# EAGLE design HapticSleeveSchematic3 - Copy (EAGLE 9.6.2)
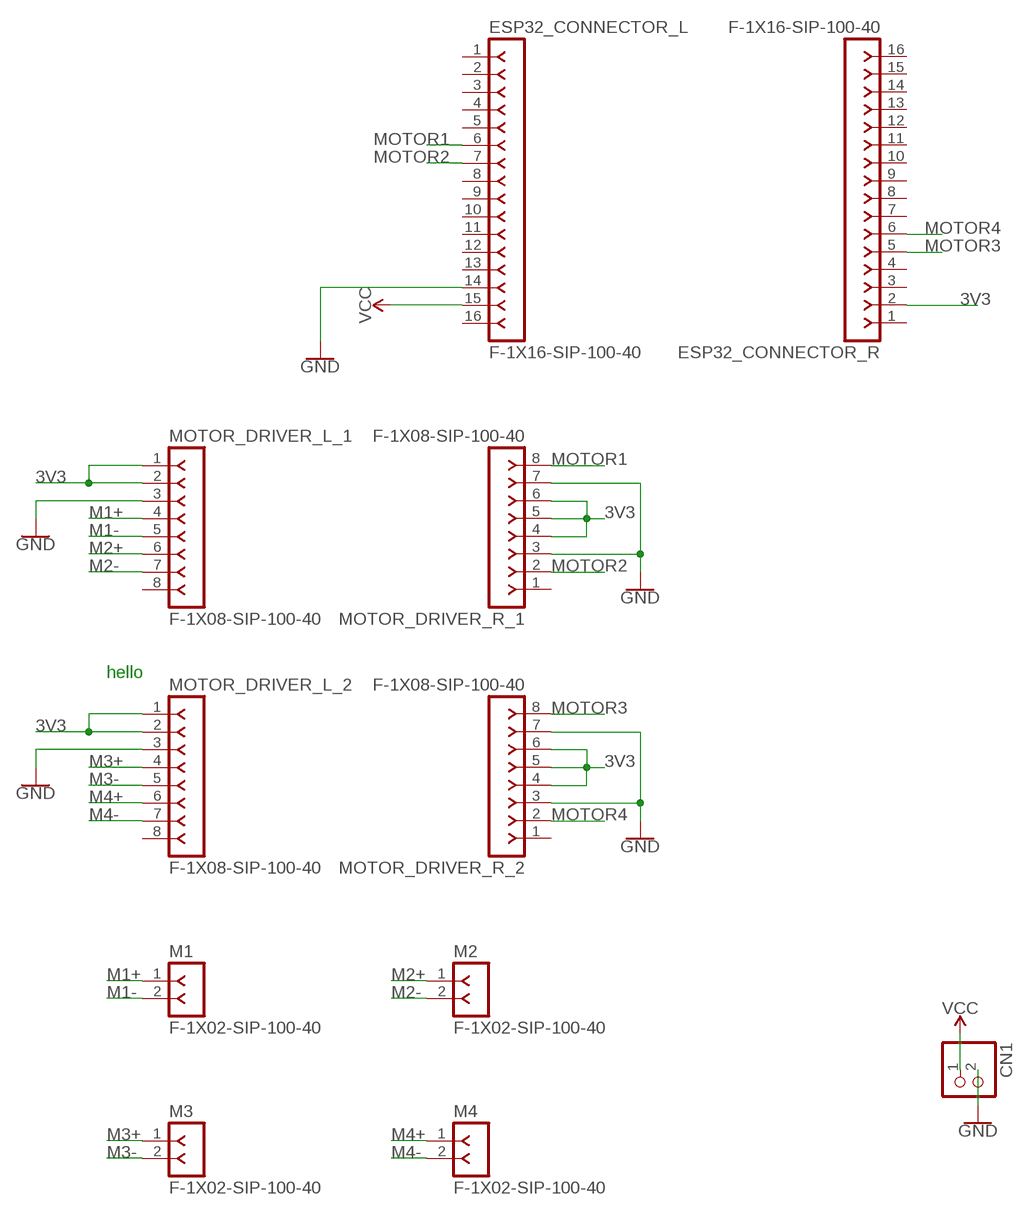
[diagram p0: schematic, sheet 1]

## Parts
CN1  JST_2PIN-THM-RA  [JST-PH-2-THM-RA]
ESP32_CONNECTOR_L  F-1X16-SIP-100-40  [SIP-100-16-40]
ESP32_CONNECTOR_R  F-1X16-SIP-100-40  [SIP-100-16-40]
M1  F-1X02-SIP-100-40  [SIP-100-02-40]
M2  F-1X02-SIP-100-40  [SIP-100-02-40]
M3  F-1X02-SIP-100-40  [SIP-100-02-40]
M4  F-1X02-SIP-100-40  [SIP-100-02-40]
MOTOR_DRIVER_L_1  F-1X08-SIP-100-40  [SIP-100-08-40]
MOTOR_DRIVER_L_2  F-1X08-SIP-100-40  [SIP-100-08-40]
MOTOR_DRIVER_R_1  F-1X08-SIP-100-40  [SIP-100-08-40]
MOTOR_DRIVER_R_2  F-1X08-SIP-100-40  [SIP-100-08-40]

## Nets
3V3: ESP32_CONNECTOR_R.2 MOTOR_DRIVER_L_1.1 MOTOR_DRIVER_L_1.2 MOTOR_DRIVER_L_2.1 MOTOR_DRIVER_L_2.2 MOTOR_DRIVER_R_1.4 MOTOR_DRIVER_R_1.5 MOTOR_DRIVER_R_1.6 MOTOR_DRIVER_R_2.4 MOTOR_DRIVER_R_2.5 MOTOR_DRIVER_R_2.6
GND: CN1.2 ESP32_CONNECTOR_L.14 MOTOR_DRIVER_L_1.3 MOTOR_DRIVER_L_2.3 MOTOR_DRIVER_R_1.3 MOTOR_DRIVER_R_1.7 MOTOR_DRIVER_R_2.3 MOTOR_DRIVER_R_2.7
M1+: M1.1 MOTOR_DRIVER_L_1.4
M1-: M1.2 MOTOR_DRIVER_L_1.5
M2+: M2.1 MOTOR_DRIVER_L_1.6
M2-: M2.2 MOTOR_DRIVER_L_1.7
M3+: M3.1 MOTOR_DRIVER_L_2.4
M3-: M3.2 MOTOR_DRIVER_L_2.5
M4+: M4.1 MOTOR_DRIVER_L_2.6
M4-: M4.2 MOTOR_DRIVER_L_2.7
MOTOR1: ESP32_CONNECTOR_L.6 MOTOR_DRIVER_R_1.8
MOTOR2: ESP32_CONNECTOR_L.7 MOTOR_DRIVER_R_1.2
MOTOR3: ESP32_CONNECTOR_R.5 MOTOR_DRIVER_R_2.8
MOTOR4: ESP32_CONNECTOR_R.6 MOTOR_DRIVER_R_2.2
VCC: CN1.1 ESP32_CONNECTOR_L.15
Unconnected: ESP32_CONNECTOR_L.1 ESP32_CONNECTOR_L.2 ESP32_CONNECTOR_L.3 ESP32_CONNECTOR_L.4 ESP32_CONNECTOR_L.5 ESP32_CONNECTOR_L.8 ESP32_CONNECTOR_L.9 ESP32_CONNECTOR_L.10 ESP32_CONNECTOR_L.11 ESP32_CONNECTOR_L.12 ESP32_CONNECTOR_L.13 ESP32_CONNECTOR_L.16 ESP32_CONNECTOR_R.1 ESP32_CONNECTOR_R.3 ESP32_CONNECTOR_R.4 ESP32_CONNECTOR_R.7 ESP32_CONNECTOR_R.8 ESP32_CONNECTOR_R.9 ESP32_CONNECTOR_R.10 ESP32_CONNECTOR_R.11 ESP32_CONNECTOR_R.12 ESP32_CONNECTOR_R.13 ESP32_CONNECTOR_R.14 ESP32_CONNECTOR_R.15 ESP32_CONNECTOR_R.16 MOTOR_DRIVER_L_1.8 MOTOR_DRIVER_L_2.8 MOTOR_DRIVER_R_1.1 MOTOR_DRIVER_R_2.1

## Notes on the sheet
- hello

## Library data of the parts
CN1 = adafruit:JST_2PIN: JST 2-Pin Connectors of various flavors SMT-RA (S2B-PH-SM4) 4UConnector #17311 SMT (B2B-PH-SM4) THM-RA (S2B-PH) THM (B2B-PH)
ESP32_CONNECTOR_L ESP32_CONNECTOR_R = con-headers-jp-1:F-1X16-: FEMALE HEADER
M1-M4 = con-headers-jp-1:F-1X02-: FEMALE HEADER
MOTOR_DRIVER_L_1 MOTOR_DRIVER_L_2 MOTOR_DRIVER_R_1 MOTOR_DRIVER_R_2 = con-headers-jp-1:F-1X08-: FEMALE HEADER

## Board
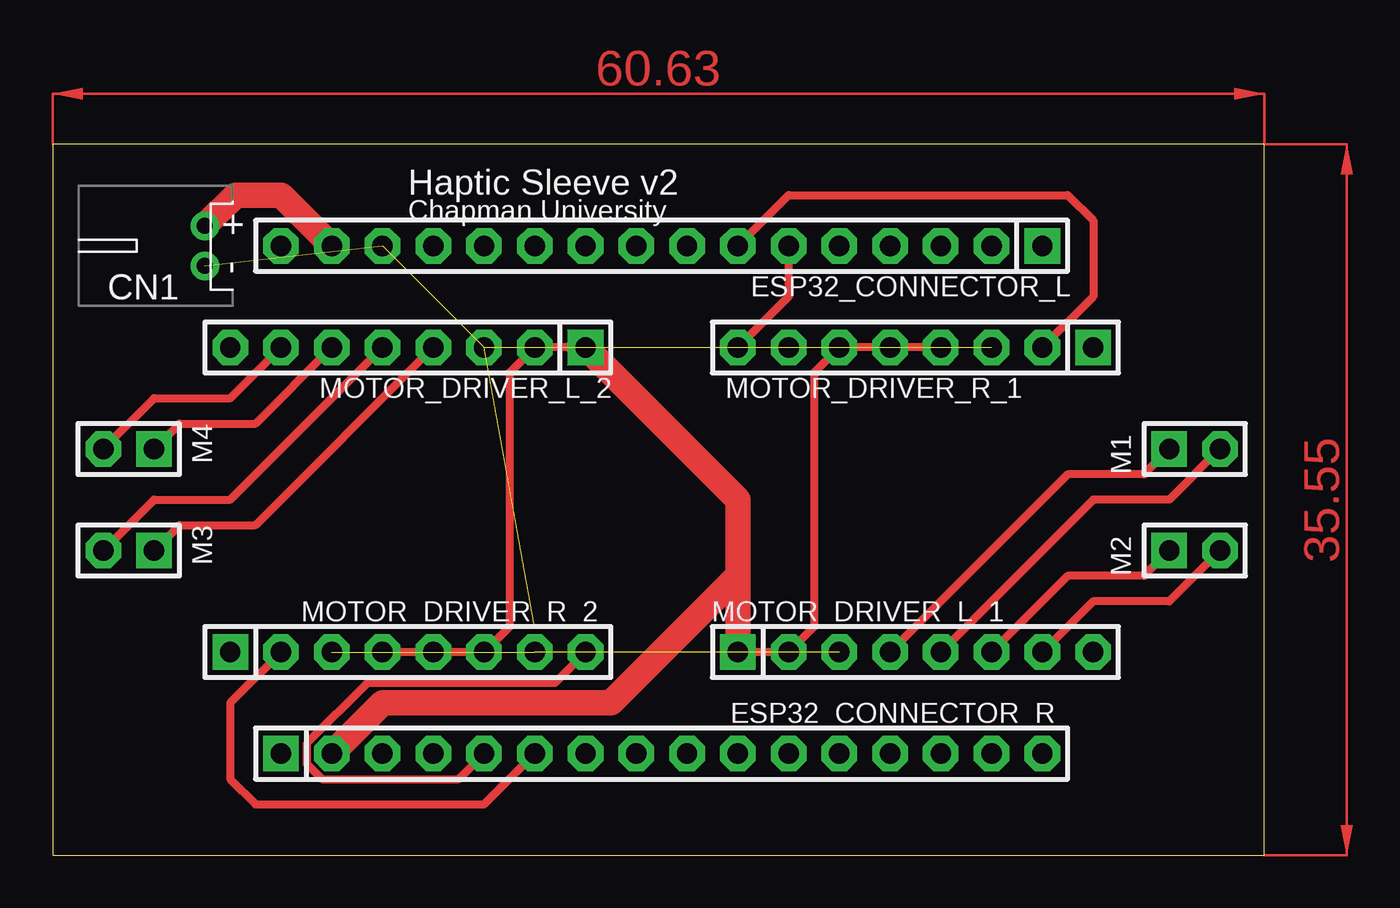
[diagram p1: board, top side]
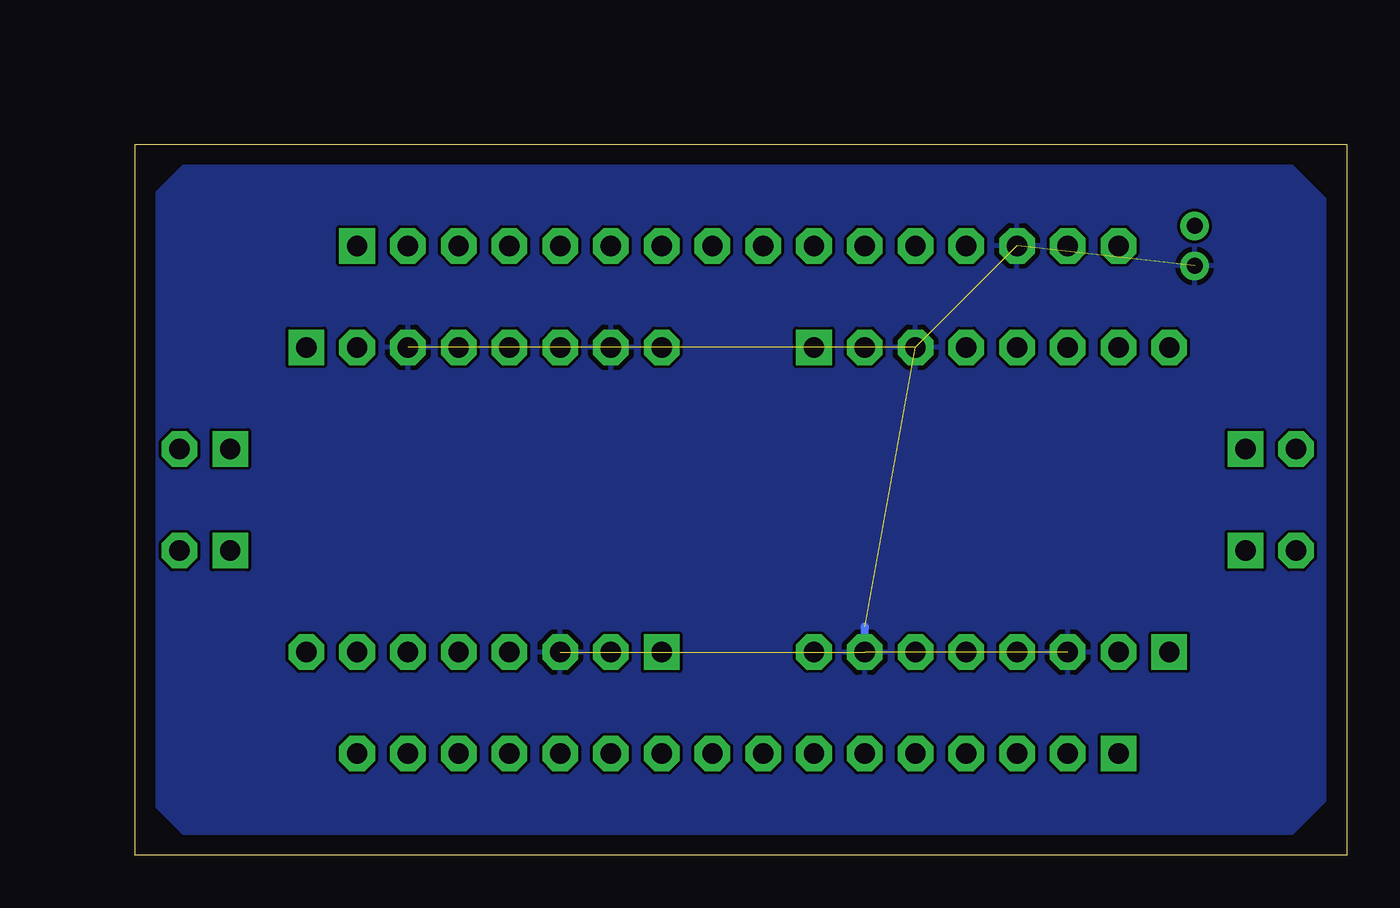
[diagram p2: board, bottom side, seen from below]

Size 60.63 x 35.55 mm. Coordinates in mm from the lower left corner, seen from the top.
Outline: 0,0 60.63,0 60.63,35.55 0,35.55 0,0
Copper layers (1*16): Top 0.035mm / dielectric 1.5mm / Bottom 0.035mm
Design rules "default": minimum track width 6mil, minimum drill 0.35mm, track to track 6mil, track to pad 6mil, pad to pad 6mil, via to via 6mil, smd to smd 6mil, copper to edge 40mil, drill to drill 6mil, minimum pad ring 10mil, minimum via ring 8mil, stop-mask expansion 4mil, vias tented up to drill 0mil, thermal gap 10mil

### Footprints (pad centres in the part's own frame; a part is rotated, then mirrored left to right if it is on the bottom)
JST-PH-2-THM-RA = drill 0.8 pad 1.422: 1 1,0; 2 -1,0
SIP-100-16-40 = drill 1.016 pad 1.778 square: 1 -19.05,0 | drill 1.016 pad 1.778 octagon: 2 -16.51,0; 3 -13.97,0; 4 -11.43,0; 5 -8.89,0; 6 -6.35,0; 7 -3.81,0; 8 -1.27,0; 9 1.27,0; 10 3.81,0; 11 6.35,0; 12 8.89,0; 13 11.43,0; 14 13.97,0; 15 16.51,0; 16 19.05,0
SIP-100-02-40 = drill 1.016 pad 1.778 square: 1 -1.27,0 | drill 1.016 pad 1.778 octagon: 2 1.27,0
SIP-100-08-40 = drill 1.016 pad 1.778 square: 1 -8.89,0 | drill 1.016 pad 1.778 octagon: 2 -6.35,0; 3 -3.81,0; 4 -1.27,0; 5 1.27,0; 6 3.81,0; 7 6.35,0; 8 8.89,0

### Placement (x,y rotation side)
CN1  7.62,30.48 90 top
ESP32_CONNECTOR_L  30.48,30.48 180 top
ESP32_CONNECTOR_R  30.48,5.08 0 top
M1  57.15,20.32 0 top
M2  57.15,15.24 0 top
M3  3.81,15.24 180 top
M4  3.81,20.32 180 top
MOTOR_DRIVER_L_1  43.18,10.16 0 top
MOTOR_DRIVER_L_2  17.78,25.4 180 top
MOTOR_DRIVER_R_1  43.18,25.4 180 top
MOTOR_DRIVER_R_2  17.78,10.16 0 top

### Tracks (layer width: path | path; a pad name or v marks a point on that pad's centre or on a via)
3V3
  Top 0.406: MOTOR_DRIVER_R_1.4 MOTOR_DRIVER_R_1.5 MOTOR_DRIVER_R_1.6 38.1,24.13 38.1,11.43 MOTOR_DRIVER_L_1.2 MOTOR_DRIVER_L_1.1 | MOTOR_DRIVER_L_2.1 MOTOR_DRIVER_L_2.2 22.86,24.13 22.86,11.43 MOTOR_DRIVER_R_2.6 MOTOR_DRIVER_R_2.5 MOTOR_DRIVER_R_2.4
  Top 1.27: MOTOR_DRIVER_L_2.1 34.29,17.78 34.29,13.97 | 34.29,13.97 MOTOR_DRIVER_L_1.1 | 34.29,13.97 27.94,7.62 16.51,7.62 ESP32_CONNECTOR_R.2
GND  (7 unrouted)
  Bottom 0.406: MOTOR_DRIVER_R_2.7 24.13,11.43
  pour Bottom: 3.81,35.56 57.15,35.56 60.96,31.75 60.96,3.81 57.15,0 3.81,0 0,3.81 0,31.75
M1+
  Top 0.406: M1.1 54.61,19.05 50.8,19.05 MOTOR_DRIVER_L_1.4
M1-
  Top 0.406: M1.2 55.88,17.78 52.07,17.78 MOTOR_DRIVER_L_1.5
M2+
  Top 0.406: M2.1 54.61,13.97 50.8,13.97 MOTOR_DRIVER_L_1.6
M2-
  Top 0.406: M2.2 55.88,12.7 52.07,12.7 MOTOR_DRIVER_L_1.7
M3+
  Top 0.406: M3.1 6.35,16.51 10.16,16.51 MOTOR_DRIVER_L_2.4
M3-
  Top 0.406: M3.2 5.08,17.78 8.89,17.78 MOTOR_DRIVER_L_2.5
M4+
  Top 0.406: M4.1 6.35,21.59 10.16,21.59 MOTOR_DRIVER_L_2.6
M4-
  Top 0.406: M4.2 5.08,22.86 8.89,22.86 MOTOR_DRIVER_L_2.7
MOTOR1
  Top 0.406: ESP32_CONNECTOR_L.6 36.83,27.94 MOTOR_DRIVER_R_1.8
MOTOR2
  Top 0.406: ESP32_CONNECTOR_L.7 36.83,33.02 50.8,33.02 52.07,31.75 52.07,27.94 MOTOR_DRIVER_R_1.2
MOTOR3
  Top 0.406: MOTOR_DRIVER_R_2.8 25.12,8.61 15.74,8.61 12.72,5.6 12.72,4.56 13.48,3.81 20.32,3.81 ESP32_CONNECTOR_R.5
MOTOR4
  Top 0.406: MOTOR_DRIVER_R_2.2 8.89,7.62 8.89,3.81 10.16,2.54 21.59,2.54 ESP32_CONNECTOR_R.6
VCC
  Top 1.27: CN1.1 9.16,33.02 11.43,33.02 ESP32_CONNECTOR_L.15
(copper drawn outside any net)
  shapes: Top area x4

### Text on the board
tPlace: Haptic Sleeve v2 | Chapman University